# EAGLE design VIC-20_AV-Adaptor (EAGLE 9.6.2)
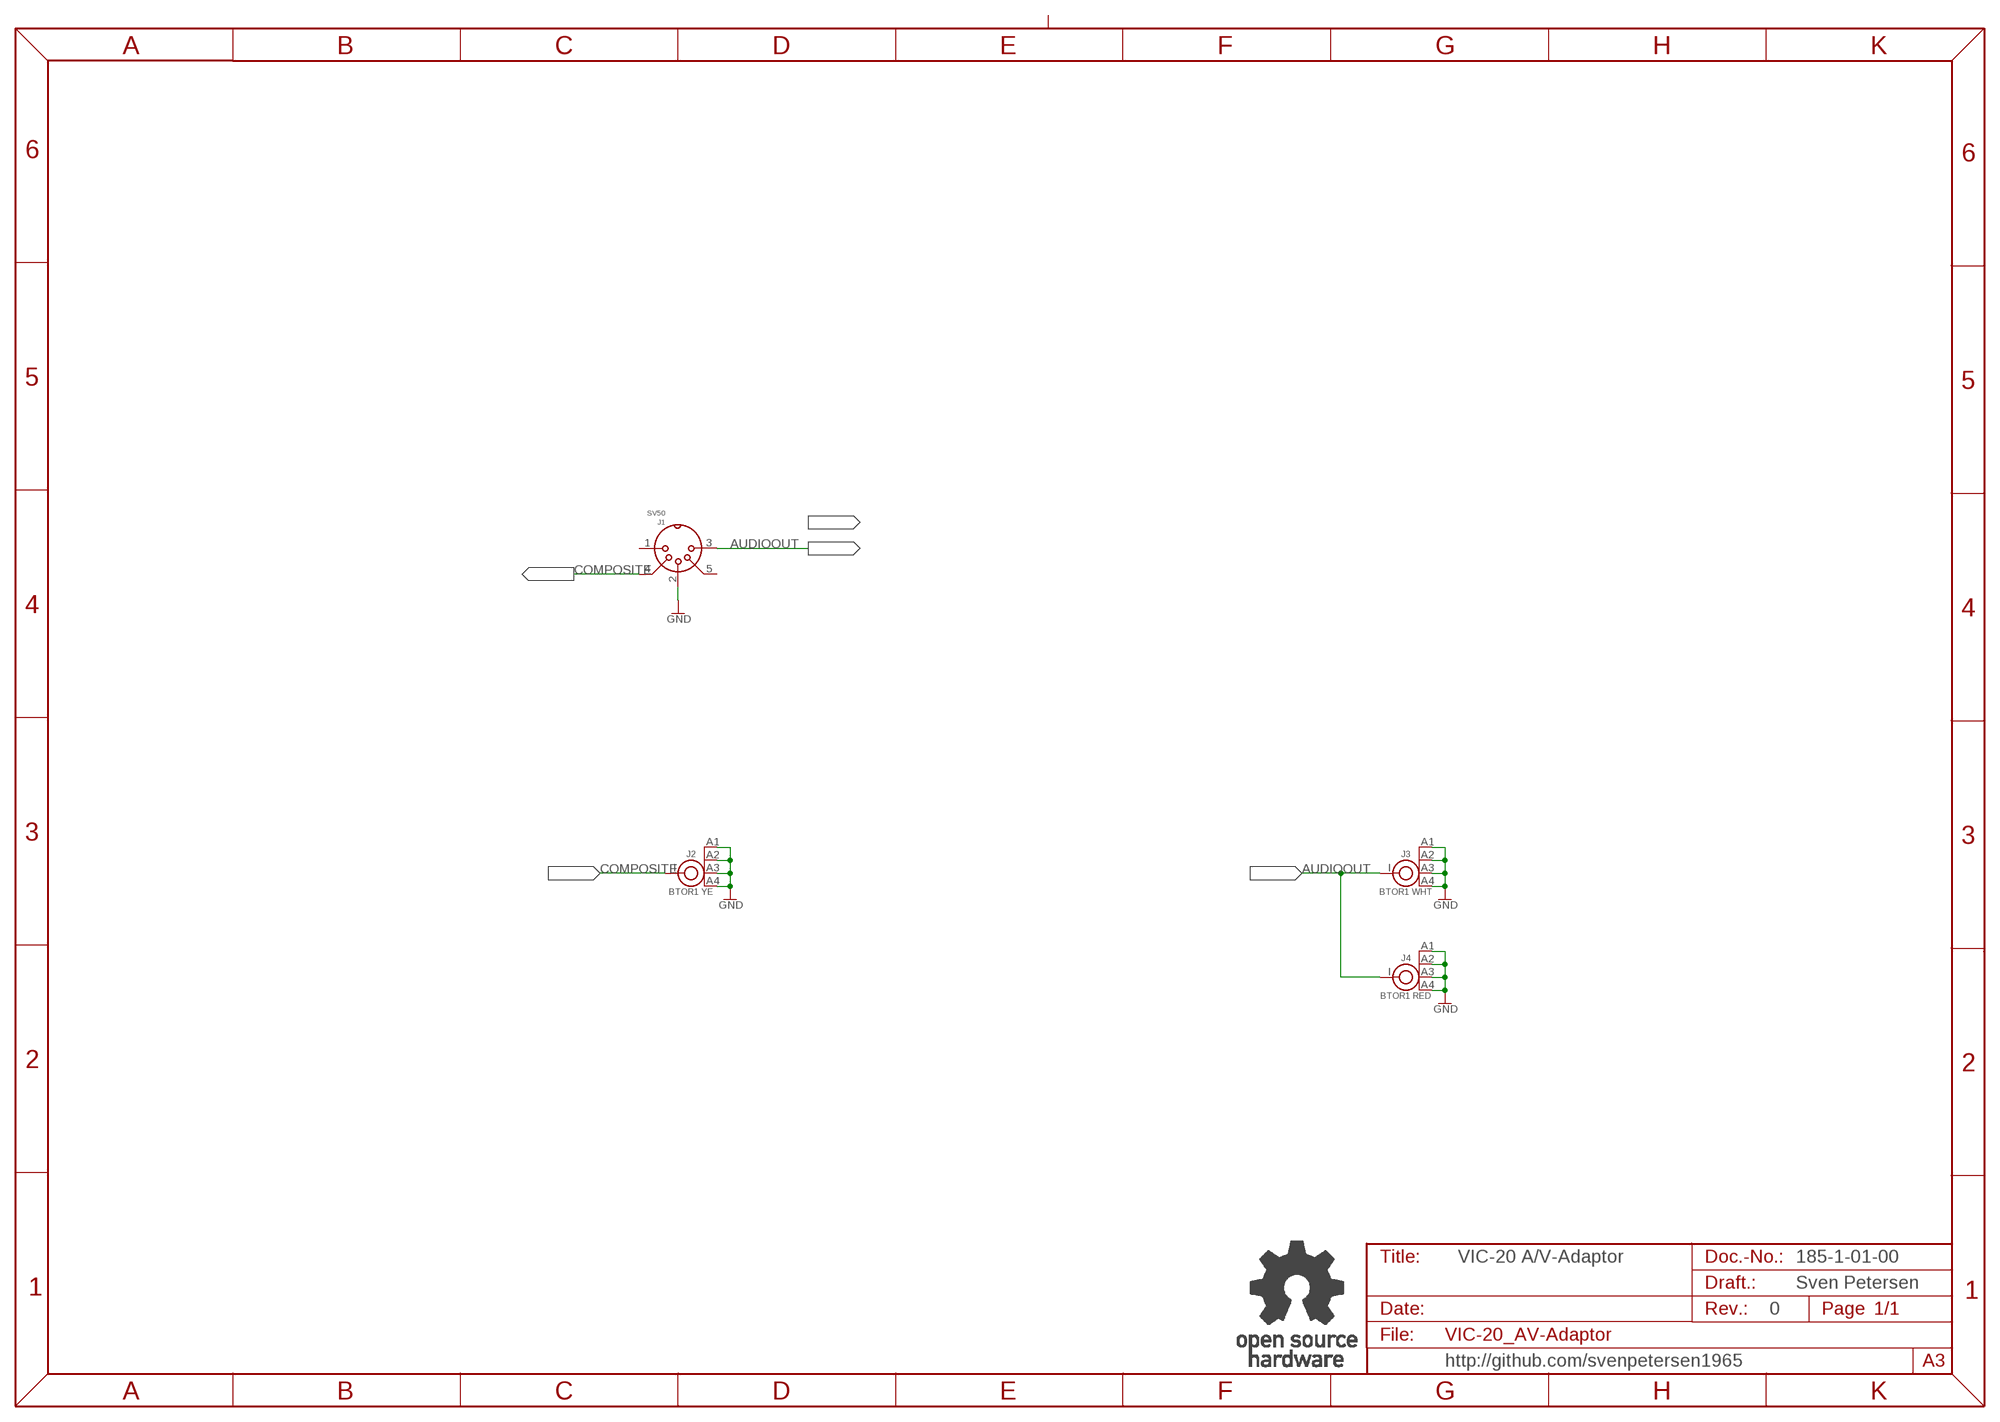
[diagram p0: schematic, sheet 1]

## Parts
J1  SV50  [SV50_INNER]
J2  BTOR1 YE  BTOR1  [BTOR1]
J3  BTOR1 WHT  BTOR1  [BTOR1]
J4  BTOR1 RED  BTOR1  [BTOR1]
U$25  OPEN_SOURCE_HW  [OPENHW]

## Nets
AUDIOOUT: J1.3 J3.I J4.I
COMPOSITE: J1.4 J2.I
GND: J1.2 J2.A1 J2.A2 J2.A3 J2.A4 J3.A1 J3.A2 J3.A3 J3.A4 J4.A1 J4.A2 J4.A3 J4.A4
Unconnected: J1.1 J1.5

## Notes on the sheet
- VIC-20 A/V-Adaptor | 185-1-01-00
- Sven Petersen
- 0
- http://github.com/svenpetersen1965

## Library data of the parts
J1 = Lumberg:SV50
J2-J4 = Lumberg:BTOR1
U$25 = Logo:OPEN_SOURCE_HW

## Board
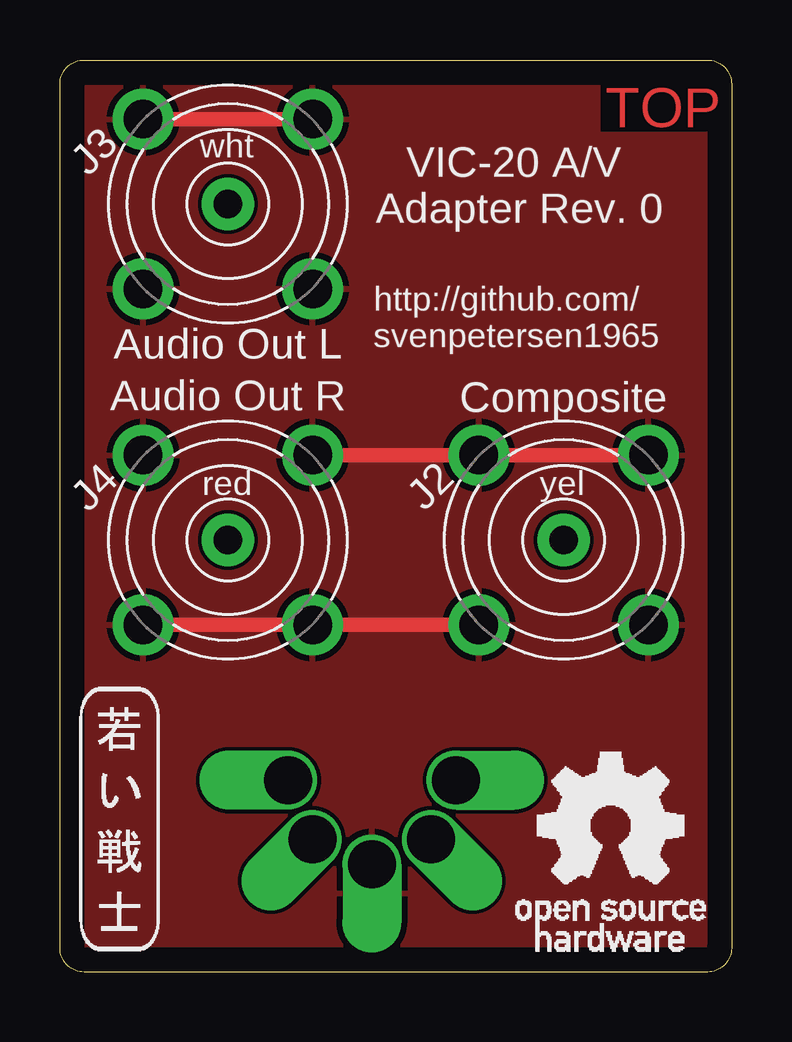
[diagram p1: board, top side]
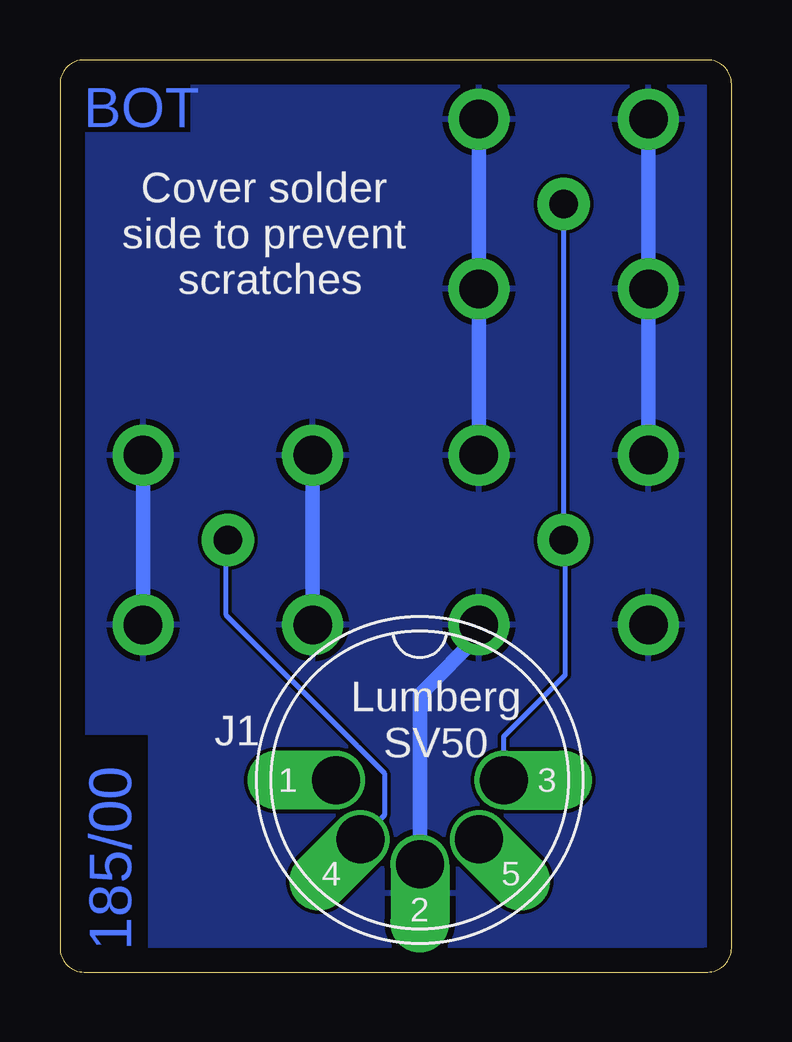
[diagram p2: board, bottom side, seen from below]

Size 28 x 38 mm. Coordinates in mm from the lower left corner, seen from the top.
Outline: 1,38 27,38 arc-90 28,37 28,1 arc-90 27,0 1,0 arc-90 0,1 0,37 arc-90 1,38
Copper layers (1*16): Top 0.035mm / dielectric 1.5mm / Bottom 0.035mm
Design rules "default *": minimum track width 6mil, minimum drill 0.35mm, track to track 6mil, track to pad 6mil, pad to pad 6mil, via to via 6mil, smd to smd 6mil, copper to edge 40mil, drill to drill 6mil, minimum pad ring 9mil, minimum via ring 8mil, stop-mask expansion 4mil, vias tented up to drill 25mil, thermal gap 10mil
tRestrict: 2 lines
bRestrict: 2 lines

### Footprints (pad centres in the part's own frame; a part is rotated, then mirrored left to right if it is on the bottom)
SV50_INNER = drill 2 pad 2.413 offset: 1 3.5,0; 2 0,3.5; 3 -3.5,0; 4 2.47,2.47; 5 -2.47,2.47
BTOR1 = drill 1.6 pad 2.54: A1 0,5; A2 5,0; A3 0,-5; A4 -5,0 | drill 1.2 pad 2.184: I 0,0

### Placement (x,y rotation side)
J1  13,8 180 bottom
J2  21,18 45 top
J3  7,32 45 top
J4  7,18 45 top
U$22  [2LAYER]  22.72,35.2 0 top
U$23  [SVEN_TAG]  2.52,6.49 0 top
U$24  [PCB-TITLE/]  0.16,44.61 0 top  (outside the outline)
U$25  19.02,0.88 0 top

### Tracks (layer width: path | path; a pad name or v marks a point on that pad's centre or on a via)
AUDIOOUT
  Bottom 0.203: J1.3 9.5,9.82 6.94,12.38 6.94,17.94 J4.I J3.I
COMPOSITE
  Bottom 0.203: J1.4 14.47,6.53 14.47,8.28 15.6,9.4 21.07,14.88 21.07,17.93 J2.I
GND
  Top 0.61: J4.A4 J4.A3 J2.A4 | J4.A2 J2.A1 J2.A2 | J3.A1 J3.A2
  Bottom 0.61: J1.2 13,11.56 10.43,14.13 10.43,14.36 J4.A3 | J4.A2 J3.A3 J3.A2 | J4.A1 J3.A4 J3.A1 | J2.A4 J2.A1 | J2.A3 J2.A2
  pour Bottom: 0.95,0.79 0.95,36.94 27.05,36.94 27.05,0.79
  pour Top: 0.95,0.79 27.05,0.79 27.05,36.94 0.95,36.94

### Text on the board
Bottom: 185/00
tPlace: wht | VIC-20 A/V / Adapter Rev. 0 | Audio Out L | http://github.com/ / svenpetersen1965 | Audio Out R | Composite | red | yel
bPlace: Cover solder / side to prevent / scratches | Lumberg / SV50
Document: Sven Petersen | 185-2-01-01 | 2021 | 35µm | 2 | 1